# EAGLE design DIGREG1 (EAGLE 6.1)
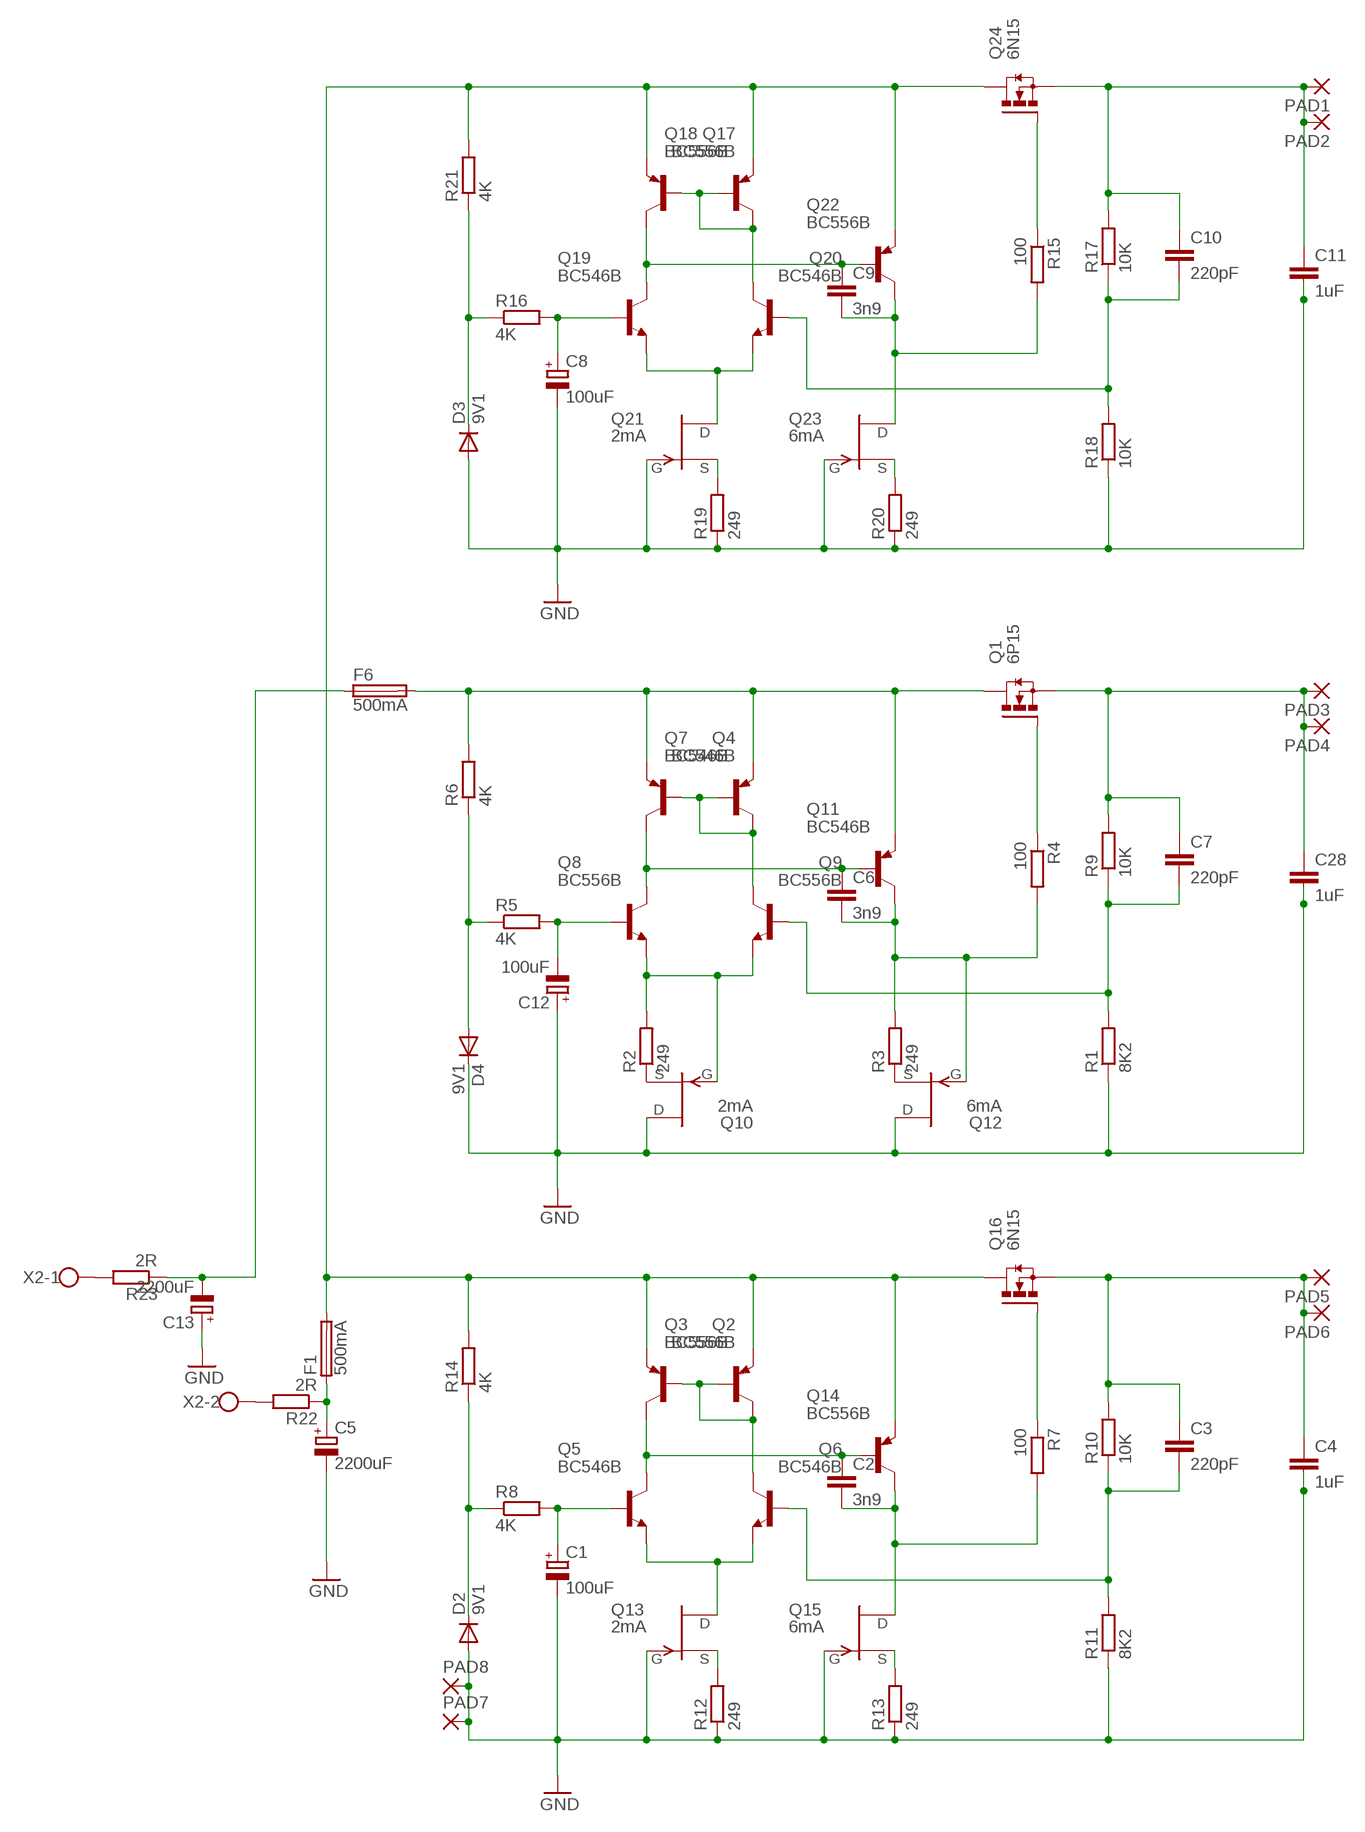
[diagram p0: schematic, sheet 1]

## Parts
C1  100uF  CPOL-EUE3.5-8  [E3,5-8]
C2  3n9  C-EUC1210K  [C1210K]
C3  220pF  C-EUC1210  [C1210]
C4  1uF  C-EU275-134X316  [C275-134X316]
C5  2200uF  CPOL-EUE7.5-18  [E7,5-18]
C6  3n9  C-EUC1210K  [C1210K]
C7  220pF  C-EUC1210  [C1210]
C8  100uF  CPOL-EUE3.5-8  [E3,5-8]
C9  3n9  C-EUC1210K  [C1210K]
C10  220pF  C-EUC1210  [C1210]
C11  1uF  C-EU275-134X316  [C275-134X316]
C12  100uF  CPOL-EUE3.5-8  [E3,5-8]
C13  2200uF  CPOL-EUE7.5-18  [E7,5-18]
C28  1uF  C-EU275-134X316  [C275-134X316]
D2  9V1  1N4148DO35-7  [DO35-7]
D3  9V1  1N4148DO35-7  [DO35-7]
D4  9V1  1N4148DO35-7  [DO35-7]
F1  500mA  19560  [19560]
F6  500mA  19560  [19560]
PAD1  3,81/1,4  [3,81/1,4]
PAD2  3,81/1,4  [3,81/1,4]
PAD3  3,81/1,4  [3,81/1,4]
PAD4  3,81/1,4  [3,81/1,4]
PAD5  3,81/1,4  [3,81/1,4]
PAD6  3,81/1,4  [3,81/1,4]
PAD7  3,81/1,4  [3,81/1,4]
PAD8  3,81/1,4  [3,81/1,4]
Q1  6P15  IRFI540NPBF  [TO220BH]
Q2  BC556B  BC560  [TO92-EBC]
Q3  BC556B  BC560  [TO92-EBC]
Q4  BC546B  BC560  [TO92-EBC]
Q5  BC546B  BC550B  [TO92-EBC]
Q6  BC546B  BC550B  [TO92-EBC]
Q7  BC546B  BC560  [TO92-EBC]
Q8  BC556B  BC550B  [TO92-EBC]
Q9  BC556B  BC550B  [TO92-EBC]
Q10  2mA  2N5484  [TO92-]
Q11  BC546B  BC560  [TO92-EBC]
Q12  6mA  2N5484  [TO92-]
Q13  2mA  2N5484  [TO92-]
Q14  BC556B  BC560  [TO92-EBC]
Q15  6mA  2N5484  [TO92-]
Q16  6N15  IRFI540NPBF  [TO220BH]
Q17  BC556B  BC560  [TO92-EBC]
Q18  BC556B  BC560  [TO92-EBC]
Q19  BC546B  BC550B  [TO92-EBC]
Q20  BC546B  BC550B  [TO92-EBC]
Q21  2mA  2N5484  [TO92-]
Q22  BC556B  BC560  [TO92-EBC]
Q23  6mA  2N5484  [TO92-]
Q24  6N15  IRFI540NPBF  [TO220BH]
R1  8K2  R-EU_R1210  [R1210]
R2  249  R-EU_R1210  [R1210]
R3  249  R-EU_R1210  [R1210]
R4  100  R-EU_0309/12  [0309/12]
R5  4K  R-EU_0309/12  [0309/12]
R6  4K  R-EU_0309/12  [0309/12]
R7  100  R-EU_0309/12  [0309/12]
R8  4K  R-EU_0309/12  [0309/12]
R9  10K  R-EU_R1210  [R1210]
R10  10K  R-EU_R1210  [R1210]
R11  8K2  R-EU_R1210  [R1210]
R12  249  R-EU_R1210  [R1210]
R13  249  R-EU_R1210  [R1210]
R14  4K  R-EU_0309/12  [0309/12]
R15  100  R-EU_0309/12  [0309/12]
R16  4K  R-EU_0309/12  [0309/12]
R17  10K  R-EU_R1210  [R1210]
R18  10K  R-EU_R1210  [R1210]
R19  249  R-EU_R1210  [R1210]
R20  249  R-EU_R1210  [R1210]
R21  4K  R-EU_0309/12  [0309/12]
R22  2R  R-EU_0309/12  [0309/12]
R23  2R  R-EU_0309/12  [0309/12]
X2  W237-102  [W237-102]

## Nets
FGD: C1.- C4.2 C5.- C8.- C11.2 C12.+ C13.+ C28.2 D2.A D3.A D4.C PAD7.1(P) PAD8.1(P) Q10.3(D) Q12.3(D) Q13.1(G) Q15.1(G) Q21.1(G) Q23.1(G) R1.1 R11.1 R12.1 R13.1 R18.1 R19.1 R20.1 ; supply symbol labelled GND
N$1: D4.A R5.1 R6.1
N$2: C7.1 C28.1 PAD3.1(P) PAD4.1(P) Q1.S R9.2
N$3: Q1.G R4.1
N$4: Q12.2(S) R3.1
N$5: F6.2 Q1.D Q4.E Q7.E Q11.E R6.2
N$6: Q10.2(S) R2.1
N$7: C3.1 C4.1 PAD5.1(P) PAD6.1(P) Q16.S R10.2
N$8: F1.2 Q2.E Q3.E Q14.E Q16.D Q17.E Q18.E Q22.E Q24.D R14.2 R21.2
N$9: C12.- Q8.B R5.2
N$10: Q4.B Q7.B Q7.C Q9.C
N$11: Q16.G R7.1
N$12: C1.+ Q5.B R8.2
N$13: Q8.E Q9.E Q10.1(G) R2.2
N$14: C6.1 Q4.C Q8.C Q11.B
N$15: Q2.B Q3.B Q3.C Q6.C
N$16: Q5.E Q6.E Q13.3(D)
N$17: C2.1 Q2.C Q5.C Q14.B
N$18: C6.2 Q11.C Q12.1(G) R3.2 R4.2
N$19: C2.2 Q14.C Q15.3(D) R7.2
N$20: C3.2 Q6.B R10.1 R11.2
N$21: C7.2 Q9.B R1.2 R9.1
N$22: D2.C R8.1 R14.1
N$23: Q13.2(S) R12.2
N$24: Q15.2(S) R13.2
N$25: C10.1 C11.1 PAD1.1(P) PAD2.1(P) Q24.S R17.2
N$26: C5.+ F1.1 R22.1
N$27: Q24.G R15.1
N$28: C8.+ Q19.B R16.2
N$29: Q17.B Q18.B Q18.C Q20.C
N$30: Q19.E Q20.E Q21.3(D)
N$31: C9.1 Q17.C Q19.C Q22.B
N$32: C9.2 Q22.C Q23.3(D) R15.2
N$33: C10.2 Q20.B R17.1 R18.2
N$34: D3.C R16.1 R21.1
N$35: Q21.2(S) R19.2
N$36: Q23.2(S) R20.2
N$37: R22.2 X2.2
N$38: R23.2 X2.1
N$39: C13.- F6.1 R23.1

## Library data of the parts
C1 C5 C8 C12 C13 = resistor:CPOL-EU: POLARIZED CAPACITOR, European symbol
C2-C4 C6 C7 C9-C11 C28 = resistor:C-EU: CAPACITOR, European symbol
D2-D4 = diode:1N4148: DIODE high speed (Philips)
F1 F6 = fuse:19560: FUSE HOLDER TR5, Wickmann
PAD1-PAD8 = wirepad:3,81/1,4: THROUGH-HOLE PAD
Q1 Q16 Q24 = transistor-power:IRFI540NPBF: HEXFET Power MOISFET VDSS = 100V, RDS(on) = 0.052 Ohm, ID = 20A, VGS(th) = 2.0 -- 4.0V Source: http://www.irf.com/product-info/datasheets/data/irfi540npbf.pdf
Q2-Q4 Q7 Q11 Q14 Q17 Q18 Q22 = transistor-pnp:BC560*: PNP Transistror
Q5 Q6 Q8 Q9 Q19 Q20 = transistor-npn:BC550*: NPN Transistor
Q10 Q12 Q13 Q15 Q21 Q23 = transistor-fet:?548*: N-Channel JFETs Source: VISHAY 2N5484.pdf Compatible: TO92 2N5245 J304 J305 U310 J308 J309 J310 TO72 2N4416 2N4416A 2N3823 2N4351 3N169 3N170 3N171 MFE3002 TO18 2N3796 2N3797 MFE825 Source: Motorola European Master Guide Pacge 3-59
R1-R23 = resistor:R-EU_: RESISTOR, European symbol
X2 = con-wago-500:W237-102: WAGO SCREW CLAMP; MPN: 237-102; OC_FARNELL: unknown; OC_NEWARK: 70K9898

## Board
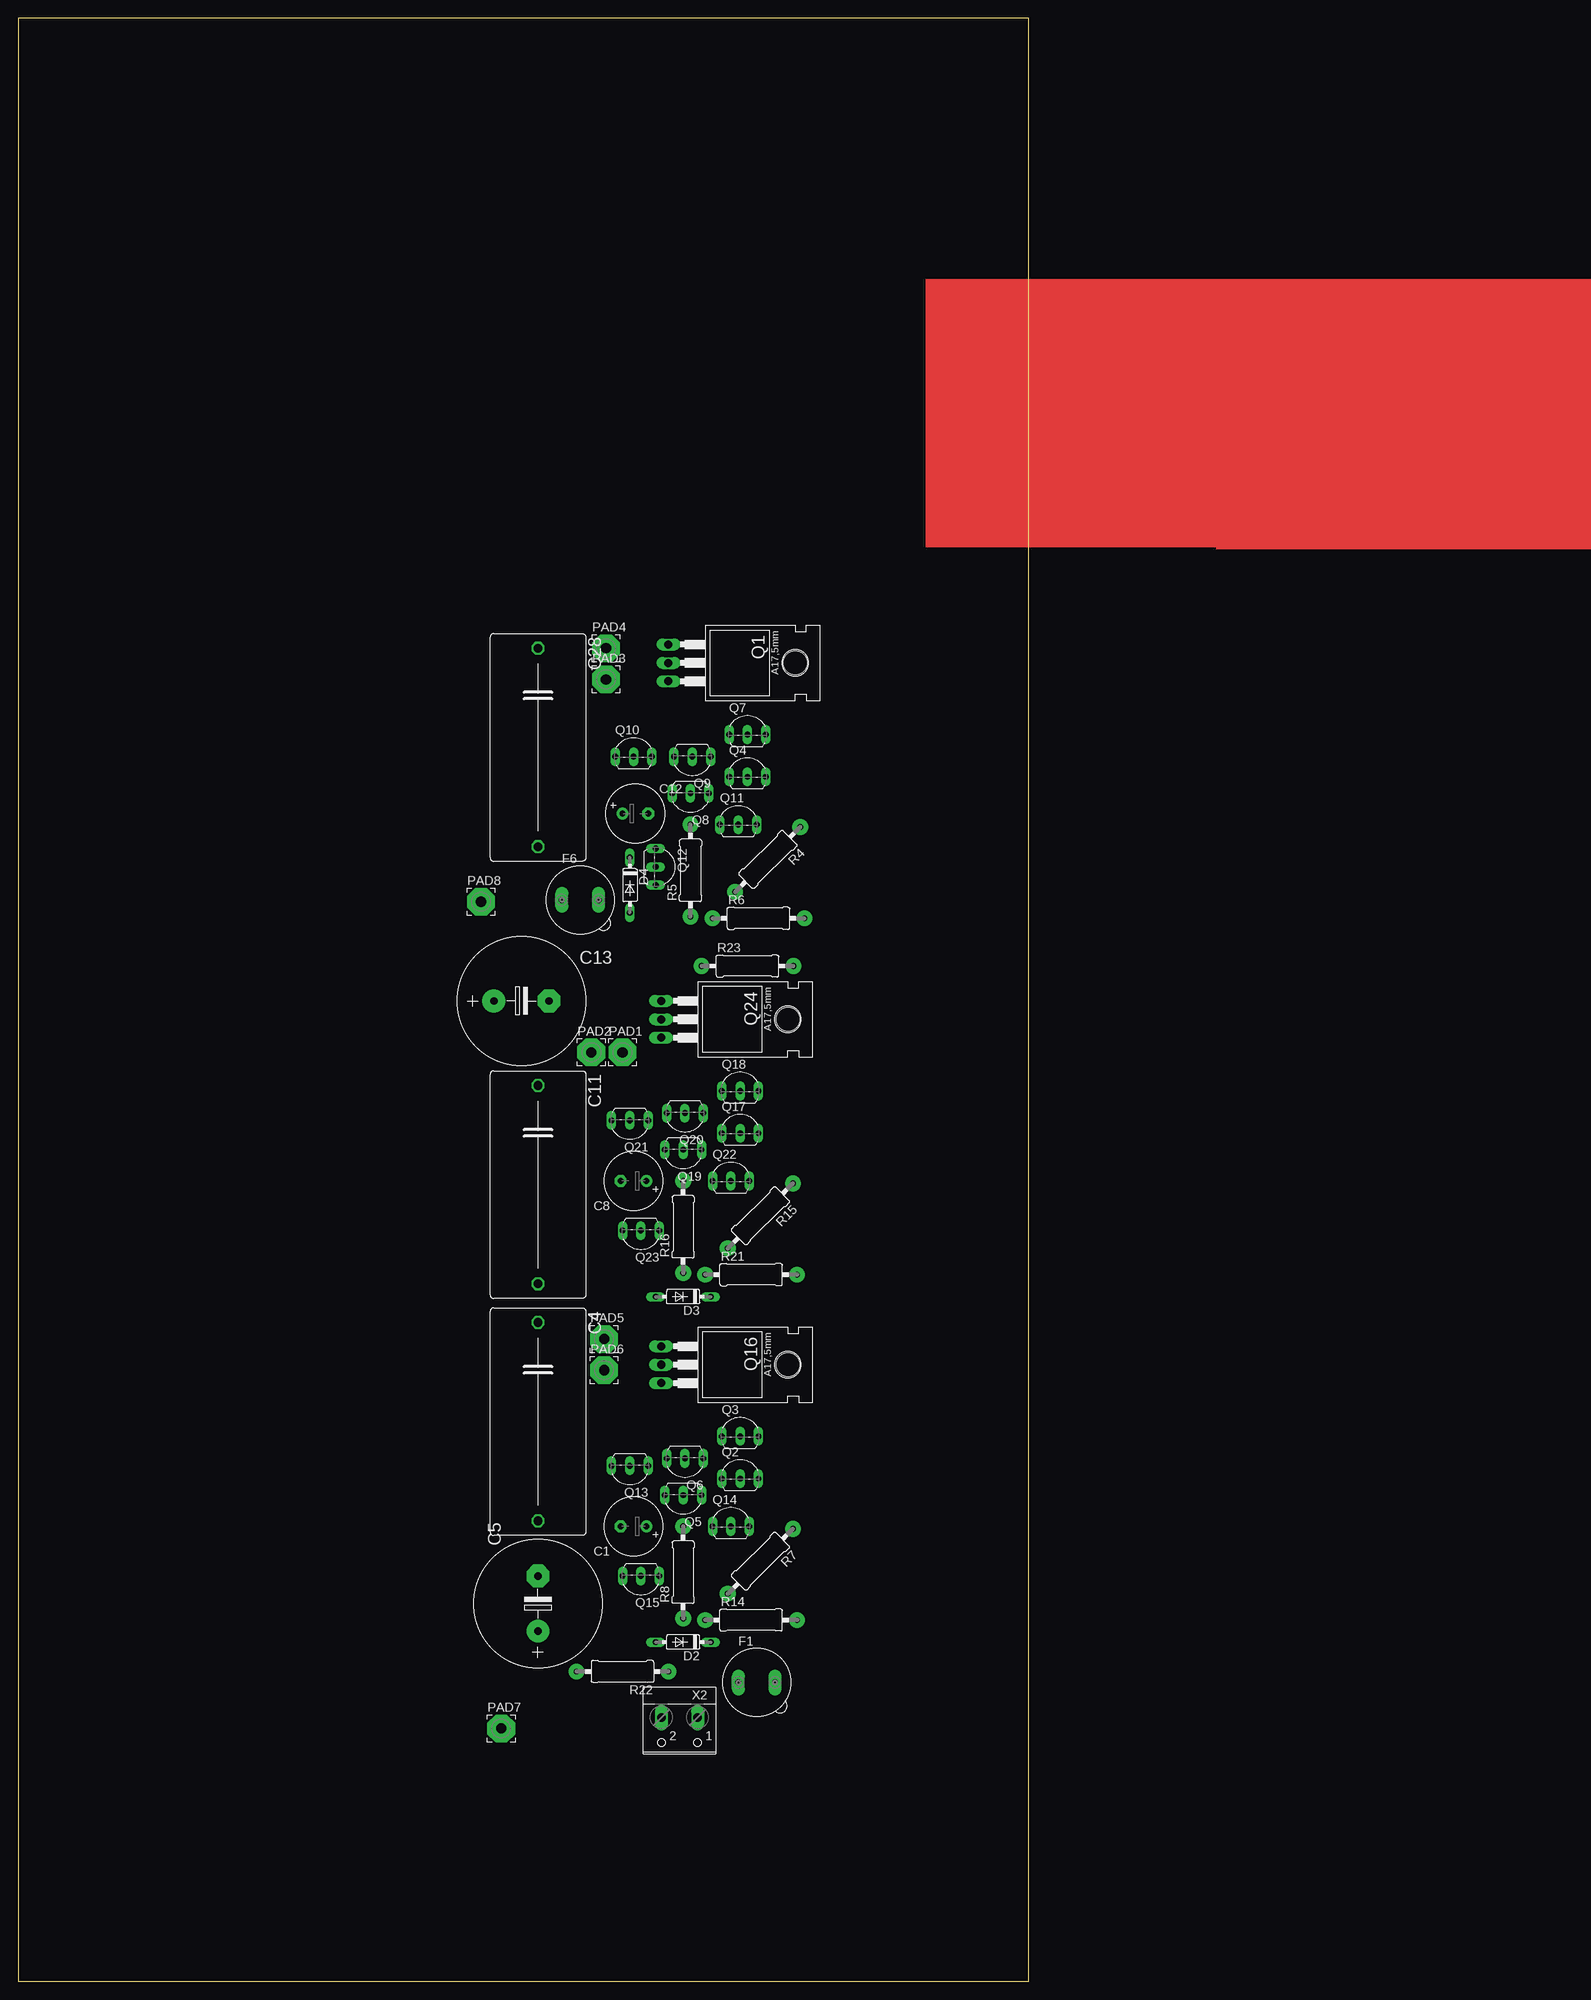
[diagram p1: board, top side]
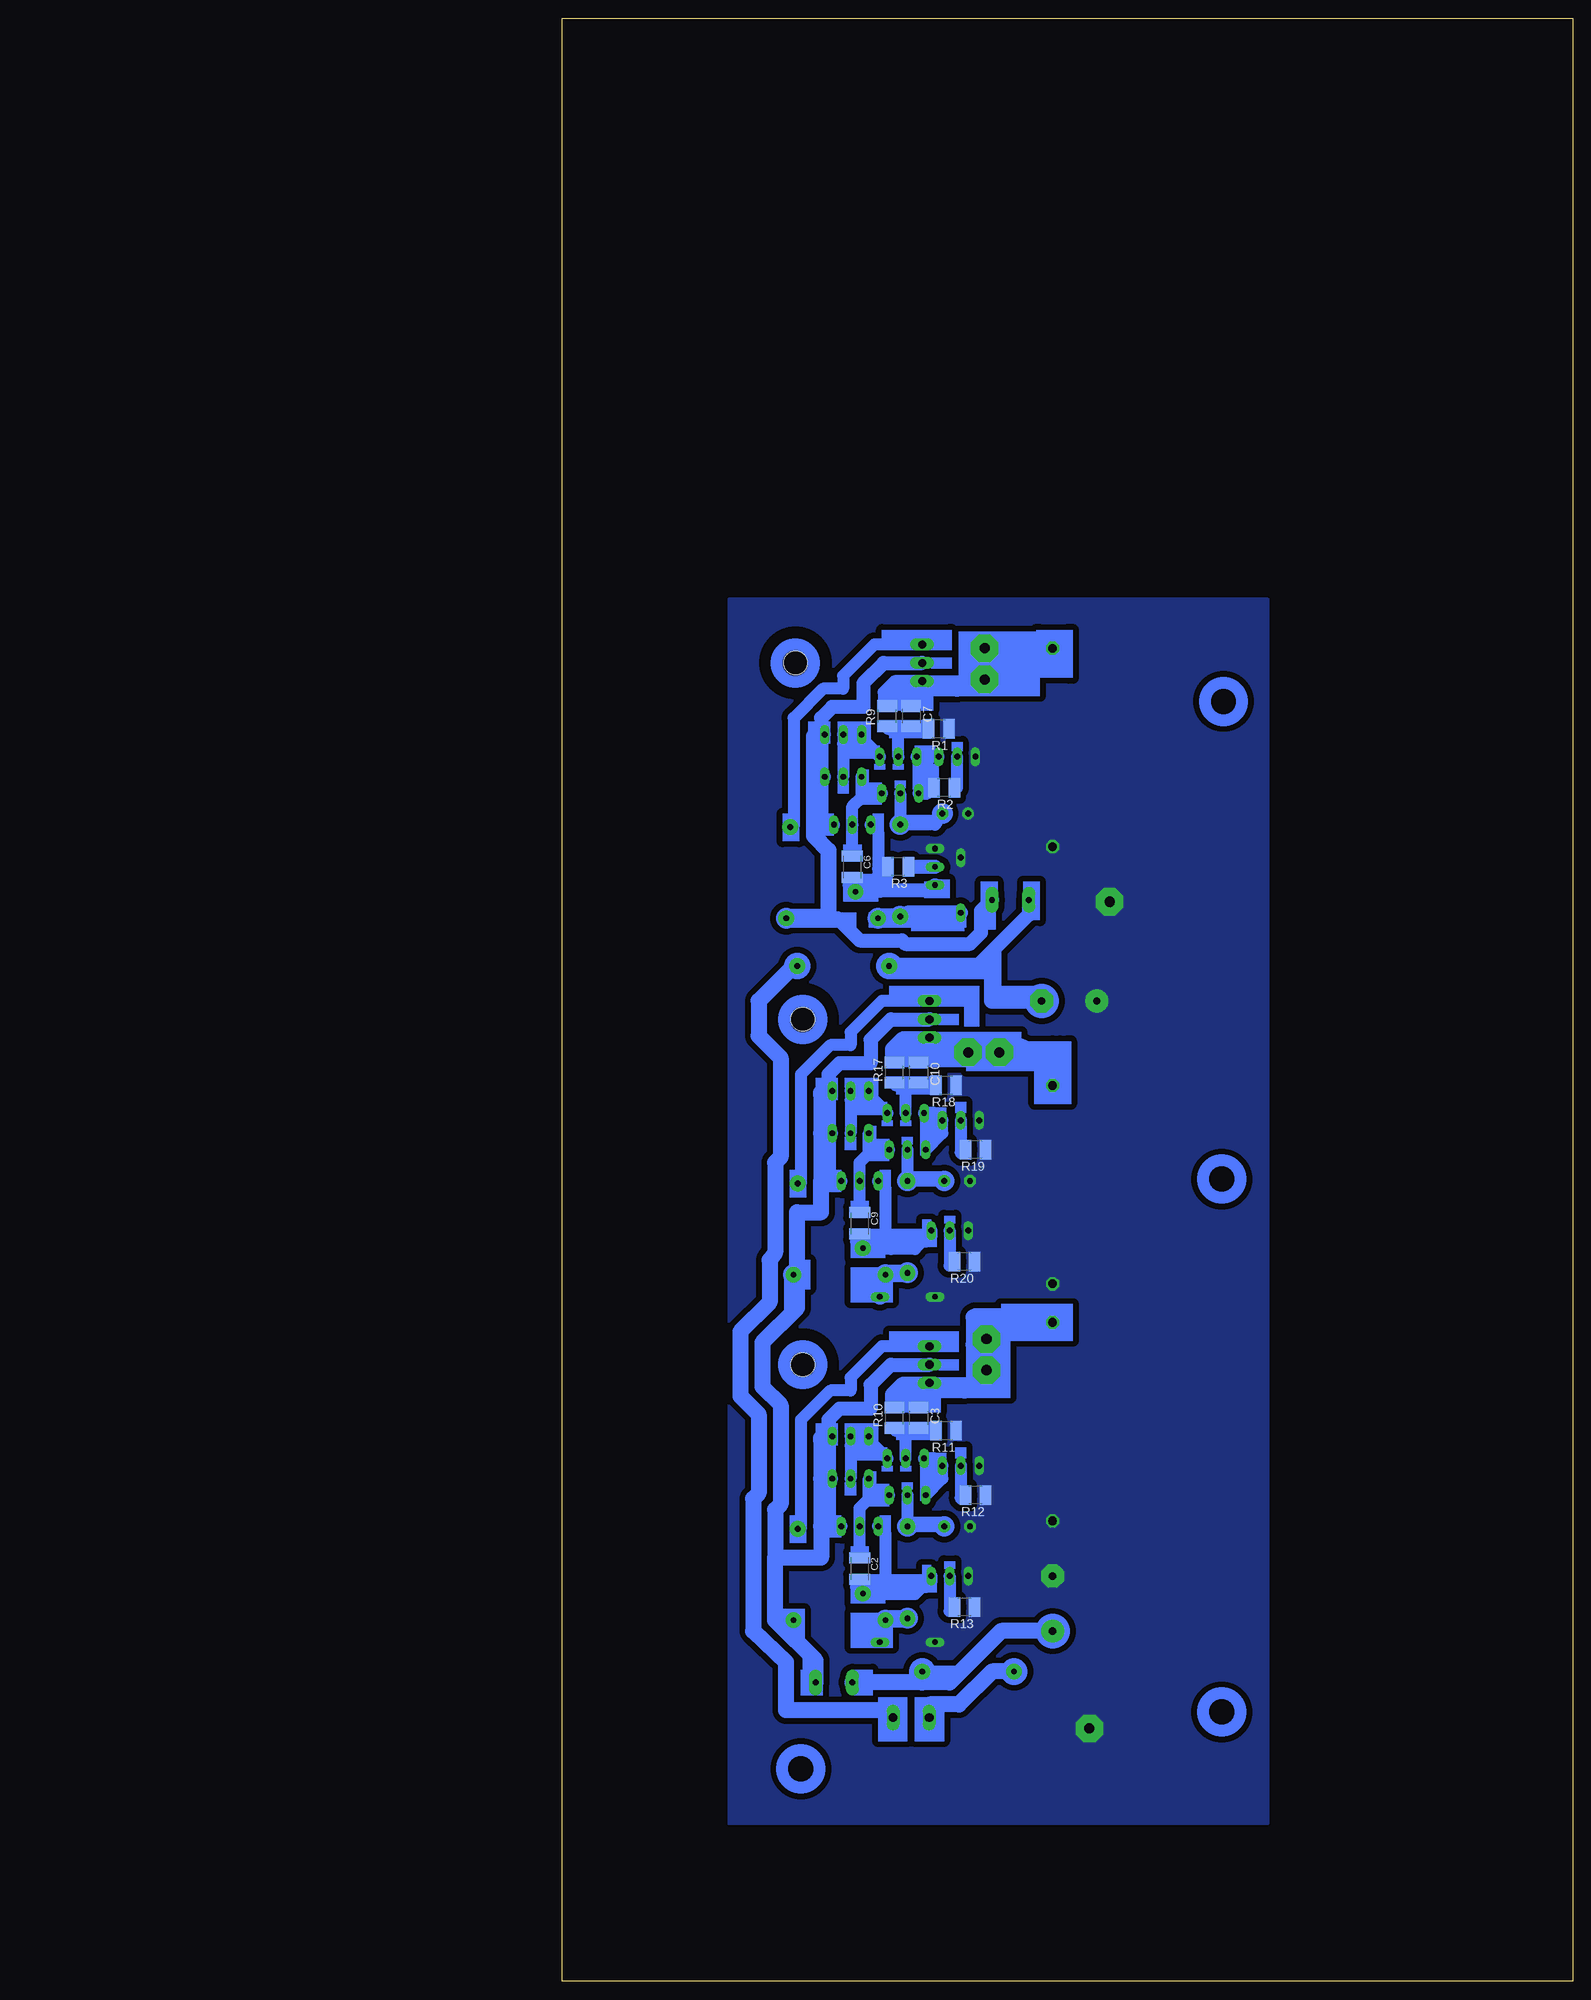
[diagram p2: board, bottom side, seen from below]

Size 139.68 x 271.45 mm. Coordinates in mm from the lower left corner, seen from the top.
Outline: 139.68,271.45 0,271.45 0,0 139.68,0 139.68,271.45
Copper layers (1*16): Top 0.035mm / dielectric 1.5mm / Bottom 0.035mm
Design rules: minimum track width 10mil, minimum drill 24mil, track to track 8mil, track to pad 8mil, pad to pad 8mil, via to via 8mil, smd to smd 8mil, copper to edge 40mil, drill to drill 8mil, minimum pad ring 10mil, minimum via ring 8mil, stop-mask expansion 4mil, vias tented up to drill 0mil, thermal gap 10mil

### Footprints (pad centres in the part's own frame; a part is rotated, then mirrored left to right if it is on the bottom)
E3,5-8 = drill 0.813 pad 1.6: + -1.778,0 | drill 0.813 pad 1.6 octagon: - 1.778,0
C1210K = smd 1.5 x 2.9: 1 -1.5,0; 2 1.5,0
C1210 = smd 1.6 x 2.7: 1 -1.4,0; 2 1.4,0
C275-134X316 = drill 1.194 octagon: 1 -13.716,0; 2 13.716,0
E7,5-18 = drill 1.016 pad 3.15: + -3.81,0 | drill 1.016 pad 3.15 octagon: - 3.81,0
DO35-7 = drill 0.813 long: A 3.81,0; C -3.81,0
19560 = drill 0.813 pad 1.778 long: 1 -2.54,0; 2 2.54,0
3,81/1,4 = drill 1.397 pad 3.81 octagon: 1 0,0
TO220BH = drill 1.118 long: D 0,-6.35; G -2.54,-6.35; S 2.54,-6.35 | hole 3.302: 0,11.176
TO92-EBC = drill 0.813 long: B 0,-1.27; C -2.54,-1.27; E 2.54,-1.27
TO92- = drill 0.813 long: 1 2.54,0; 2 0,0; 3 -2.54,0
R1210 = smd 1.6 x 2.7: 1 -1.4,0; 2 1.4,0
0309/12 = drill 0.8 pad 2.184: 1 -6.35,0; 2 6.35,0
W237-102 = drill 1.194 long: 1 -2.5,-1.27; 2 2.5,-1.27

### Placement (x,y rotation side)
C1  85.07,62.92 180 top
C2  98.53,57.07 270 bottom
C3  90.4,77.9 270 bottom
C4  71.86,77.39 270 top
C5  71.86,52.25 90 top
C6  99.55,154.1 270 bottom
C7  91.42,174.93 270 bottom
C8  85.07,110.67 180 top
C9  98.53,104.83 270 bottom
C10  90.4,125.65 270 bottom
C11  71.86,110.16 270 top
C12  85.32,161.47 0 top
C13  69.58,135.56 0 top
C28  71.86,170.61 270 top
D2  91.93,46.91 180 top
D3  91.93,94.67 180 top
D4  84.56,151.56 270 top
F1  102.09,41.33 0 top
F6  77.7,149.53 0 top
PAD1  83.55,128.45 0 top
PAD2  79.23,128.45 0 top
PAD3  81.26,180.01 0 top
PAD4  81.26,184.33 0 top
PAD5  81.01,88.82 0 top
PAD6  81.01,84.51 0 top
PAD7  66.78,34.98 0 top
PAD8  63.99,149.28 0 top
Q1  96.25,182.3 270 top
Q2  99.8,70.79 0 top
Q3  99.8,76.63 0 top
Q4  100.82,167.82 0 top
Q5  91.93,65.96 180 top
Q6  92.18,71.04 180 top
Q7  100.82,173.66 0 top
Q8  92.94,162.99 180 top
Q9  93.2,168.07 180 top
Q10  85.07,169.34 0 top
Q11  99.55,161.21 0 top
Q12  88.12,154.1 270 top
Q13  84.56,71.3 180 top
Q14  98.53,64.19 0 top
Q15  86.09,56.06 180 top
Q16  95.23,85.27 270 top
Q17  99.8,118.54 0 top
Q18  99.8,124.38 0 top
Q19  91.93,113.72 180 top
Q20  92.18,118.8 180 top
Q21  84.56,119.05 180 top
Q22  98.53,111.94 0 top
Q23  86.09,103.81 180 top
Q24  95.23,133.02 270 top
R1  87.61,173.15 180 bottom
R2  86.85,165.02 180 bottom
R3  93.2,154.1 180 bottom
R4  103.61,155.12 224.8 top
R5  92.94,153.59 90 top
R6  102.34,146.99 0 top
R7  102.6,58.09 224.8 top
R8  91.93,56.57 90 top
R9  94.72,174.93 90 bottom
R10  93.71,77.9 90 bottom
R11  86.59,76.12 180 bottom
R12  82.53,67.23 180 bottom
R13  84.05,51.74 180 bottom
R14  101.33,49.96 0 top
R15  102.6,105.84 224.8 top
R16  91.93,104.32 90 top
R17  93.71,125.65 90 bottom
R18  86.59,123.88 180 bottom
R19  82.53,114.99 180 bottom
R20  84.05,99.49 180 bottom
R21  101.33,97.71 0 top
R22  83.55,42.85 180 top
R23  100.82,140.39 0 top
X2  91.42,35.23 180 top

### Tracks (layer width: path | path; a pad name or v marks a point on that pad's centre or on a via)
FGD
  pour Bottom (isolate 0.813, no thermals): 116.57,21.77 116.57,191.19 42.14,191.19 42.14,21.77
N$1
  Bottom 1.93: D4.A 91.93,147.75 92.69,146.99 92.94,146.99 R5.1
  Bottom 2.184: R5.1 95.74,147.24 R6.1
N$2
  Bottom 0.406: 83.8,184.07 84.05,184.07 84.05,183.31 83.8,183.31 83.8,184.33 | PAD3.1 83.8,180.01
  Bottom 1.676: 91.17,176.45 91.42,176.45 | 91.42,176.45 94.72,176.45 R9.2 | C7.1 91.42,176.45 | 91.42,176.45 91.93,176.96 91.93,178.74 | 92.44,179.76 92.18,179.5 | Q1.S 93.71,179.76 95.23,178.23 95.23,176.96 92.94,179.25 92.18,179.25
  Bottom 1.778: 91.93,178.74 92.18,178.99 92.18,179.25 92.18,179.5
  Bottom 2.184: C28.1 PAD4.1 83.8,184.33 83.8,184.07 83.8,180.01 85.07,178.74 91.93,178.74
N$3
  Bottom 1.676: 107.93,159.66 107.93,159.44 107.68,159.69 107.68,174.68 103.61,178.74 100.82,178.74 100.82,180.52 96.5,184.84 Q1.G | R4.1 107.93,159.66 | 107.93,159.66 107.93,159.69
N$4
  Bottom 1.676: 91.17,154.1 R3.1
  Bottom 1.93: Q12.2 91.17,154.1
N$5
  Bottom 1.676: 104.37,172.39 103.87,172.39 Q7.E 103.61,172.14 104.88,172.14 | Q4.E 104.88,166.55 | Q11.E 104.88,159.94
  Bottom 1.93: Q1.D 95.23,182.3 98.02,179.5 98.02,176.2 102.34,176.2 103.87,174.68 103.87,172.39 | F6.2 81.77,148.01 81.77,144.96 83.29,143.43 92.18,143.43 92.69,143.94 98.53,143.94 101.58,146.99 103.1,146.99
  Bottom 2.184: 104.37,172.39 104.88,171.88 | 104.88,171.88 104.88,166.55 104.88,159.94 104.88,158.42 102.85,156.39 102.85,146.99 103.1,146.99 R6.2 | 104.88,172.14 104.88,171.88
N$6
  Bottom 1.676: R2.1 85.07,165.02 Q10.2
N$7
  Bottom 0.406: PAD5.1 PAD6.1 82.78,84.51 82.78,88.06
  Bottom 1.676: 90.15,79.43 90.4,79.43 | 90.4,79.43 93.71,79.43 R10.2 | C3.1 90.4,79.43 | 90.4,79.43 90.91,79.93 90.91,81.71 | 91.42,82.73 91.17,82.47 | Q16.S 92.69,82.73 94.21,81.2 94.21,79.93 91.93,82.22 91.17,82.22
  Bottom 1.778: 90.91,81.71 91.17,81.97 91.17,82.22 91.17,82.47
  Bottom 1.93: 82.78,91.87 82.53,92.13 73.89,92.13 72.88,91.11 C4.1
  Bottom 2.184: 82.78,91.87 82.78,88.06 82.78,82.98 84.05,81.71 90.91,81.71
N$8
  Bottom 1.676: 103.36,75.36 102.85,75.36 Q3.E 102.6,75.11 103.87,75.11 | Q2.E 103.87,69.52 | Q14.E 103.87,62.92 | 103.36,123.11 102.85,123.11 Q18.E 102.6,122.86 103.87,122.86 | Q17.E 103.87,117.27 | Q22.E 103.87,110.67
  Bottom 1.93: Q16.D 94.21,85.27 97.01,82.47 97.01,79.17 101.33,79.17 102.85,77.65 102.85,75.36 | Q24.D 94.21,133.02 97.01,130.23 97.01,126.92 101.33,126.92 102.85,125.4 102.85,123.11
  Bottom 2.184: 103.36,75.36 103.87,74.85 | 103.87,74.85 103.87,69.52 103.87,62.92 103.87,58.6 110.22,58.6 | 103.87,75.11 103.87,74.85 | 103.36,123.11 103.87,122.61 | 103.87,122.61 103.87,117.27 103.87,110.67 103.87,106.35 107.17,106.35 107.17,97.71 | 103.87,122.86 103.87,122.61 | 110.22,58.6 110.22,65.2 109.45,65.96 109.45,79.68 111.99,82.22 111.99,88.32 107.17,93.14 107.17,97.71 | 109.83,49.58 109.96,49.71 110.22,49.96 110.22,58.6 | R14.2 108.06,49.58 109.83,49.58 | R21.2 107.17,97.71 | F1.2 104.63,44.37 109.83,49.58
N$9
  Bottom 1.676: Q8.B 92.94,160.45 | 92.94,160.45 88.37,160.45 88.12,160.2 88.12,159.94 C12.- | R5.2 92.94,160.45
N$10
  Bottom 1.676: 100.82,171.12 Q7.B Q7.C | 100.82,171.12 Q4.B | Q9.C 97.52,171.12 100.82,171.12
N$11
  Bottom 1.676: 106.91,62.63 106.91,62.41 106.66,62.66 106.66,77.65 102.6,81.71 99.8,81.71 99.8,83.49 95.48,87.81 Q16.G | R7.1 106.91,62.63 | 106.91,62.63 106.91,62.66
N$12
  Bottom 1.676: Q5.B 91.93,63.42 | C1.+ 87.36,63.42 91.93,63.42 | R8.2 91.93,63.42
N$13
  Bottom 1.676: R2.2 89.13,165.02 | 89.13,165.02 89.13,169.34 | 89.13,169.34 Q10.1 | Q9.E 89.13,169.34 | Q8.E 89.13,164.26 89.13,165.02
N$14
  Bottom 1.676: Q8.C 98.28,164.26 | 98.28,164.26 Q4.C | 98.28,164.26 98.28,163.75 99.55,162.48 Q11.B C6.1
N$15
  Bottom 1.676: 99.8,74.09 Q3.B Q3.C | 99.8,74.09 Q2.B | Q6.C 96.5,74.09 99.8,74.09
N$16
  Bottom 1.676: Q6.E 88.12,72.31 Q13.3 87.1,69.52 Q5.E
N$17
  Bottom 1.676: Q5.C 97.26,67.23 | 97.26,67.23 Q2.C | 97.26,67.23 97.26,66.73 98.53,65.46 Q14.B C2.1
N$18
  Bottom 1.676: Q11.C 95.99,158.93 95.99,153.85 | 95.99,153.85 95.99,152.83 | 95.99,152.83 97.26,151.56 98.79,151.56 | 98.79,151.56 100.06,151.56 99.55,152.07 C6.2 | R4.2 98.79,150.71 98.79,151.56 | 95.99,151.31 95.99,152.83 | R3.2 94.85,153.85 95.99,153.85
  Bottom 1.93: Q12.1 88.88,150.8 95.74,150.8 96.25,151.31 | 96.25,151.31 98.53,151.31 | 96.25,151.31 95.99,151.31
N$19
  Bottom 1.676: Q14.C 94.98,61.9 94.98,55.8 | 94.98,55.8 96.25,54.53 97.77,54.53 | 97.77,54.53 99.04,54.53 98.53,55.04 C2.2 | R7.2 97.77,53.68 97.77,54.53 | Q15.3 88.63,55.3 89.39,54.53 89.9,54.53 90.91,53.52 94.21,53.52 94.98,54.28 94.98,55.8
N$20
  Bottom 0.813: 90.91,76.12 92.18,76.12 | R11.2 90.4,76.12 C3.2
  Bottom 1.676: R10.1 93.58,76.12 92.18,76.12 Q6.B | 90.91,76.12 90.66,76.38 C3.2
N$21
  Bottom 0.813: 91.93,173.15 93.2,173.15 | R1.2 91.42,173.15 C7.2
  Bottom 1.676: R9.1 94.6,173.15 93.2,173.15 Q9.B | 91.93,173.15 91.67,173.41 C7.2
N$22
  Bottom 0.813: D2.C 95.74,49.2
  Bottom 2.184: R8.1 94.72,50.22 R14.1 95.74,49.2
N$23
  Bottom 1.676: Q13.2 84.56,66.98 | 84.56,66.73 84.56,66.98 | 84.56,66.98 84.31,67.23 R12.2
N$24
  Bottom 1.676: Q15.2 86.09,51.23 85.58,51.23 85.58,51.62 R13.2
N$25
  Bottom 0.406: 76.69,129.46 76.69,128.7 77.7,128.7 77.7,128.45 PAD2.1 PAD1.1
  Bottom 1.676: 90.15,127.18 90.4,127.18 | 90.4,127.18 93.71,127.18 R17.2 | C10.1 90.4,127.18 | 90.4,127.18 90.91,127.69 90.91,129.46 | 91.42,130.48 91.17,130.23 | Q24.S 92.69,130.48 94.21,128.96 94.21,127.69 91.93,129.97 91.17,129.97
  Bottom 1.778: 90.91,129.46 91.17,129.72 91.17,129.97 91.17,130.23
  Bottom 2.184: 90.91,129.46 76.69,129.46 71.86,127.43 C11.1
N$26
  Bottom 2.184: C5.+ 78.97,48.44 86.09,41.33 89.9,41.33 | 89.9,41.33 F1.1 | R22.1 89.9,41.33
N$27
  Bottom 1.676: 106.91,110.38 106.91,110.16 106.66,110.41 106.66,125.4 102.6,129.46 99.8,129.46 99.8,131.24 95.48,135.56 Q24.G | R15.1 106.91,110.38 | 106.91,110.38 106.91,110.41
N$28
  Bottom 1.676: Q19.B 91.93,111.18 | C8.+ 87.36,111.18 91.93,111.18 | R16.2 91.93,111.18
N$29
  Bottom 1.676: 99.8,121.84 Q18.B Q18.C | 99.8,121.84 Q17.B | Q20.C 96.5,121.84 99.8,121.84
N$30
  Bottom 1.676: Q20.E 88.12,120.07 Q21.3 87.1,117.27 Q19.E
N$31
  Bottom 1.676: Q19.C 97.26,114.99 | 97.26,114.99 Q17.C | 97.26,114.99 97.26,114.48 98.53,113.21 Q22.B C9.1
N$32
  Bottom 1.676: Q22.C 94.98,109.65 94.98,103.56 | 94.98,103.56 96.25,102.29 97.77,102.29 | 97.77,102.29 99.04,102.29 98.53,102.79 C9.2 | R15.2 97.77,101.43 97.77,102.29 | Q23.3 88.63,103.05 89.39,102.29 89.9,102.29 90.91,101.27 94.21,101.27 94.98,102.03 94.98,103.56
N$33
  Bottom 0.813: 90.91,123.88 92.18,123.88 | R18.2 90.4,123.88 C10.2
  Bottom 1.676: R17.1 93.58,123.88 92.18,123.88 Q20.B | 90.91,123.88 90.66,124.13 C10.2
N$34
  Bottom 2.184: R16.1 94.72,97.97 R21.1 95.74,96.95 D3.C
N$35
  Bottom 1.676: Q21.2 84.56,114.73 | 84.56,114.48 84.56,114.73 | 84.56,114.73 84.31,114.99 R19.2
N$36
  Bottom 1.676: Q23.2 86.09,98.98 85.58,98.98 85.58,99.37 R20.2
N$37
  Bottom 2.184: R22.2 80.24,42.85 84.82,38.28 88.88,38.28 88.88,36.5 | 88.88,36.5 88.88,36.25 | X2.2 88.88,36.5
N$38
  Bottom 2.184: R23.2 107.68,140.39 112.5,135.56 112.5,130.73 109.45,127.69 109.45,113.97 110.22,113.21 110.22,100.76 110.98,99.75 110.98,93.9 115.04,89.84 115.04,80.95 112.5,78.41 112.5,67.49 113.26,66.73 113.26,48.44 108.69,44.12 108.69,37.52 94.94,37.52 X2.1
N$39
  Bottom 1.93: F6.1 75.16,147.5 82.28,140.39 80.24,140.39
  Bottom 2.184: C13.- 80.24,135.56 80.24,140.39 R23.1
(copper drawn outside any net)
  shapes: Bottom area x219, Bottom circle x31, Top area x4